# Altium project HARSH_Payload.PrjPCB (part 1 of 2)
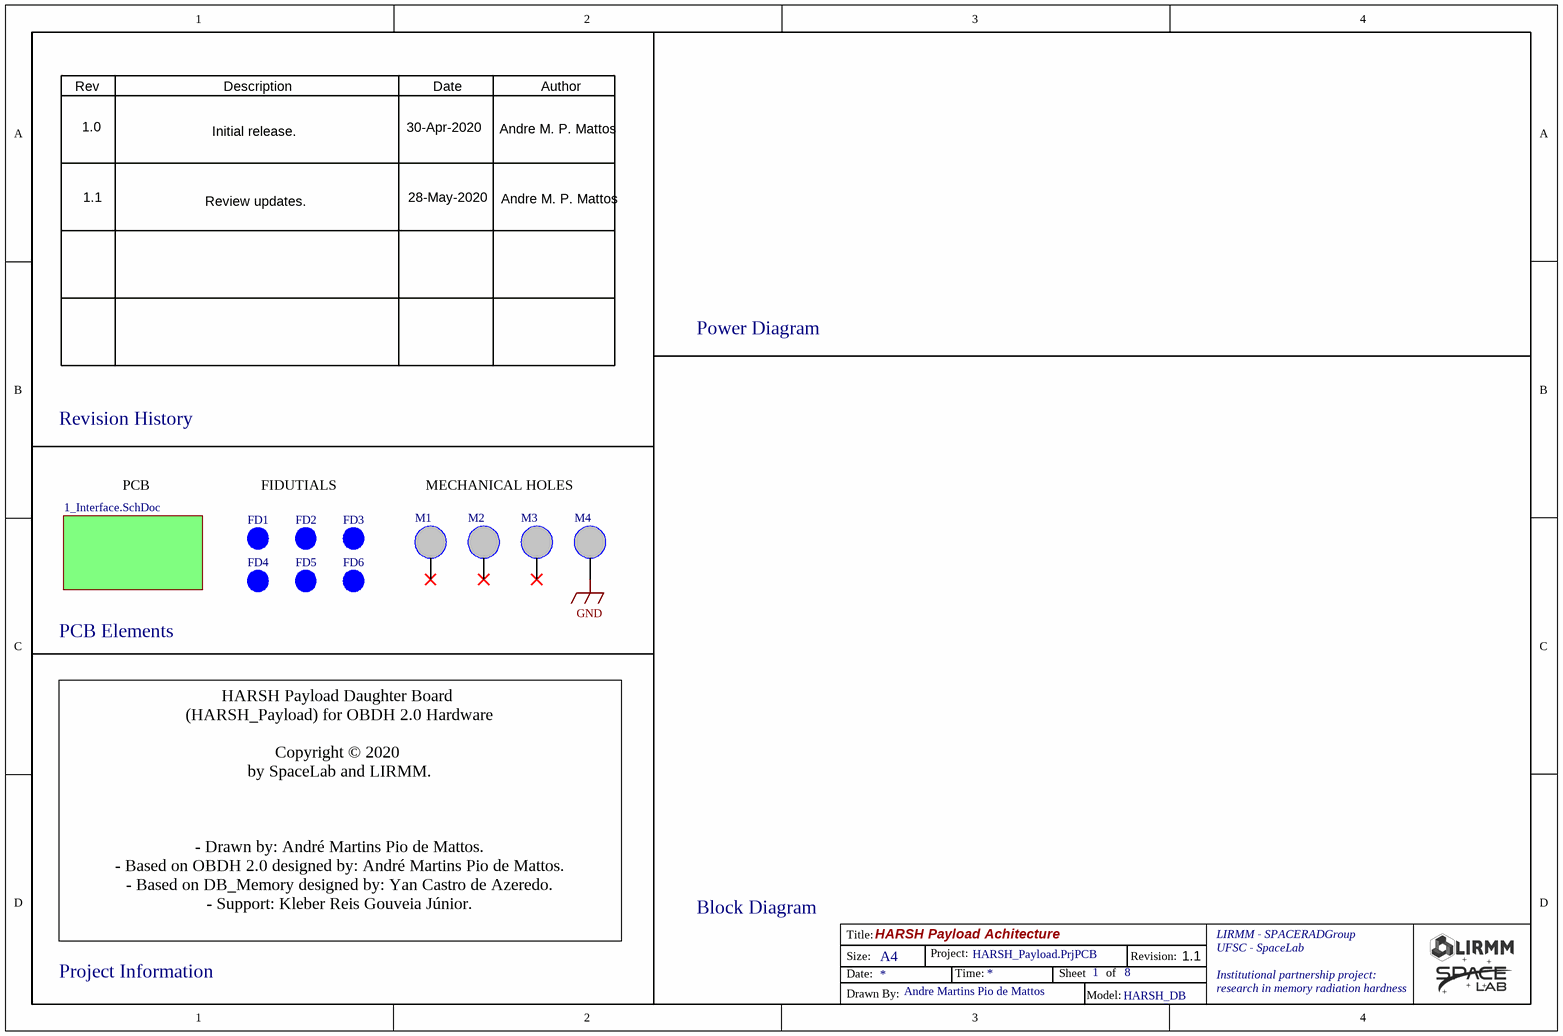
[diagram p0: 0_Architecture.SchDoc]
8 sheets, 143 parts. Net scope: flat (ports and power ports of the same name join across sheets).
Board file: HARSH_Payload.PcbDoc
Sheets:
  0_Architecture.SchDoc
    Interface = 1_Interface.SchDoc
      Topology = 2_Topology.SchDoc
        Memories = 3_SDRAM_Memories.SchDoc
        Banks_0_2 = 4_FPGA_Banks_0_2.SchDoc
        Banks_4_7 = 5_FPGA_Banks_4_7.SchDoc
        Power_Supply = 7_Power_Supply.SchDoc
        FPGA_Misc = 6_FPGA_Miscellaneous.SchDoc

## Sheet 0_Architecture.SchDoc
size A4; Organization: SpaceLab UFSC; Address1: UFSC - SpaceLab; Address2: University Campus - Trindade; Address3: Dep. of Electrical Engineering - CTC; Address4: Florianópolis, Santa Catarina, Brazil; Address5: CEP: 88040 - 900

### Parts
FD1  DONE_FIDUCIAL  [DONE_FIDUCIAL]  (value not drawn)
FD2  DONE_FIDUCIAL  [DONE_FIDUCIAL]  (value not drawn)
FD3  DONE_FIDUCIAL  [DONE_FIDUCIAL]  (value not drawn)
FD4  DONE_FIDUCIAL  [DONE_FIDUCIAL]  (value not drawn)
FD5  DONE_FIDUCIAL  [DONE_FIDUCIAL]  (value not drawn)
FD6  DONE_FIDUCIAL  [DONE_FIDUCIAL]  (value not drawn)
M1  DONE_MOUNT_HOLE  [DONE_M3_MOUNT_HOLE]  (value not drawn)
M2  DONE_MOUNT_HOLE  [DONE_M3_MOUNT_HOLE]  (value not drawn)
M3  DONE_MOUNT_HOLE  [DONE_M3_MOUNT_HOLE]  (value not drawn)
M4  DONE_MOUNT_HOLE  [DONE_M3_MOUNT_HOLE]  (value not drawn)

### Sub-sheets
Interface = 1_Interface.SchDoc: no entries

### Nets
GND: M4.0

Not connected (* = marked no-connect by the designer): M1 0*; M2 0*; M3 0*

### Notes on the sheet
- Rev
- Description
- Date
- Author
- 1.0
- Initial release.
- 30-Apr-2020
- Andre M. P. Mattos
- 1.1
- Review updates.
- 28-May-2020
- Power Diagram
- Revision History
- PCB
- FIDUTIALS
- MECHANICAL HOLES
- PCB Elements
- Block Diagram
- HARSH Payload Daughter Board
  (HARSH_Payload) for OBDH 2.0 Hardware
  Copyright © 2020
  by SpaceLab and LIRMM.
  - Drawn by: André Martins Pio de Mattos.
  - Based on OBDH 2.0 designed by: André Martins Pio de Mattos.
  - Based on DB_Memory designed by: Yan Castro de Azeredo.
  - Support: Kleber Reis Gouveia Júnior.
- Project Information
- HARSH Payload Achitecture
- HARSH_Payload.PrjPCB
- 1
- 8
- Andre Martins Pio de Mattos
- HARSH_DB
- Title:
- Size:
- Date:
- A4
- Project:
- Time:
- Sheet
- of
- Revision:
- LIRMM - SPACERADGroup
- UFSC - SpaceLab
- Institutional partnership project:
- research in memory radiation hardness
- Drawn By:
- Model:

### Library data of the parts
FD1-FD6 = DONE_FIDUCIAL: Fiducial for DB board variants
M1-M4 = DONE_MOUNT_HOLE: Mechanical Hole for DB board variants

## Sheet 1_Interface.SchDoc
size A4; Organization: SpaceLab UFSC; Address1: UFSC - SpaceLab; Address2: University Campus - Trindade; Address3: Dep. of Electrical Engineering - CTC; Address4: Florianópolis, Santa Catarina, Brazil; Address5: CEP: 88040 - 900
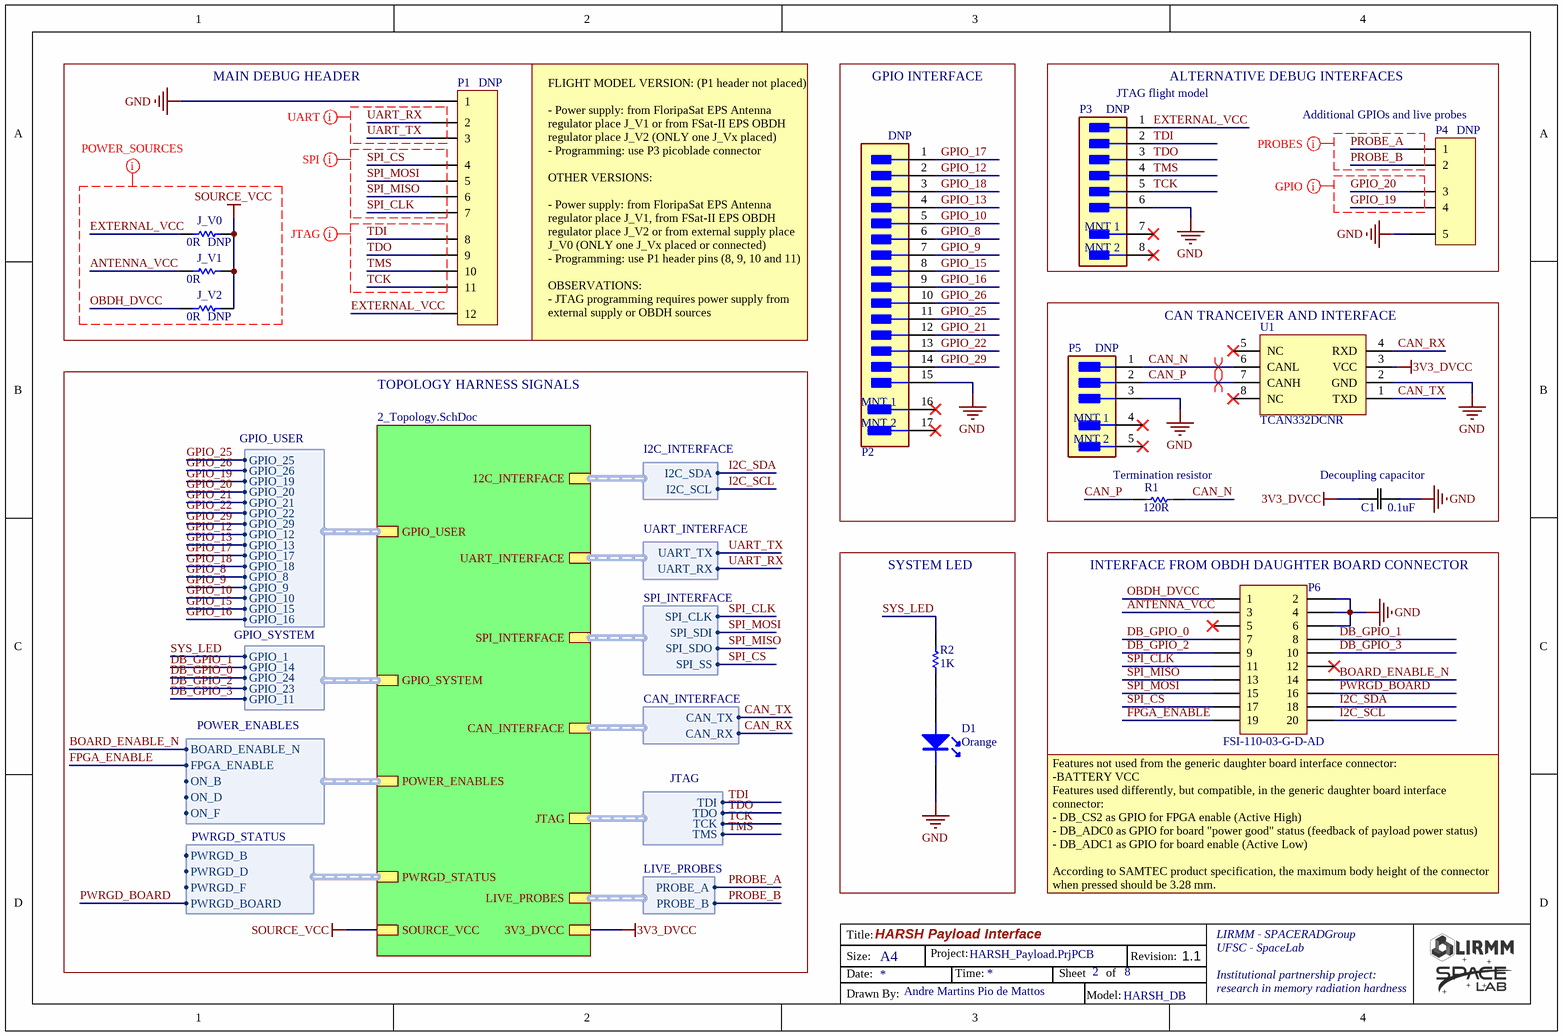
[diagram p1: 1_Interface.SchDoc]

### Parts
C1  Capacitance: 0.1uF  [DONE_C0603]  (hidden comment: 100nF/50V)
D1  Orange  [DONE_D0603_ORANGE]
J_V0  0R  [DONE_R0603]
J_V1  0R  [DONE_R0603]
J_V2  0R  [DONE_R0603]
P1  Header 12H  [DONE_H1X12_PADS]  (value not drawn)
P2  53261-1571  [DONE_PICOBLADE_15H_HORIZONTAL]  (value not drawn)
P3  53261-0671  [DONE_PICOBLADE_6H_HORIZONTAL]  (value not drawn)
P4  Header 5H  [DONE_H1X5_PADS]  (value not drawn)
P5  53261-0371  [DONE_PICOBLADE_3H_HORIZONTAL]  (value not drawn)
P6  FSI-110-03-G-D-AD  [DONE_DB_INTERFACE]
R1  120R  [DONE_R0603]
R2  1K  [DONE_R0603]
U1  TCAN332DCNR  [DONE_TSOT_23_8]

### Blocks framed on the sheet
MAIN DEBUG HEADER: J_V0-J_V2 P1
GPIO INTERFACE: P2
ALTERNATIVE DEBUG INTERFACES: P3 P4
CAN TRANCEIVER AND INTERFACE: C1 P5 R1 U1
SYSTEM LED: D1 R2
INTERFACE FROM OBDH DAUGHTER BOARD CONNECTOR: P6

### Sub-sheets
Topology = 2_Topology.SchDoc: UART_INTERFACE (harness UART_INTERFACE), POWER_ENABLES (harness POWER_ENABLES), GPIO_USER (harness GPIO_USER), GPIO_SYSTEM (harness GPIO_SYSTEM), CAN_INTERFACE (harness CAN_INTERFACE), 12C_INTERFACE (harness I2C_INTERFACE), 3V3_DVCC, SOURCE_VCC, SPI_INTERFACE (harness SPI_INTERFACE), PWRGD_STATUS (harness PWRGD_STATUS), JTAG (harness JTAG), LIVE_PROBES (harness LIVE_PROBES)

### Harnesses
CAN_INTERFACE: CAN_TX, CAN_RX
SPI_INTERFACE: SPI_SDO, SPI_SDI, SPI_SS, SPI_CLK
I2C_INTERFACE: I2C_SDA, I2C_SCL
UART_INTERFACE: UART_TX, UART_RX
JTAG: TMS, TCK, TDO, TDI
GPIO_USER: GPIO_25, GPIO_26, GPIO_19, GPIO_20, GPIO_21, GPIO_22, GPIO_29, GPIO_12, GPIO_13, GPIO_17, GPIO_18, GPIO_8, GPIO_9, GPIO_10, GPIO_15, GPIO_16
LIVE_PROBES: PROBE_A, PROBE_B
GPIO_SYSTEM: GPIO_1, GPIO_14, GPIO_24, GPIO_23, GPIO_11
POWER_ENABLES: FPGA_ENABLE, ON_B, BOARD_ENABLE_N, ON_D, ON_F
PWRGD_STATUS: PWRGD_B, PWRGD_D, PWRGD_F, PWRGD_BOARD

### Nets
3V3_DVCC: C1.1 U1.3(VCC) ; sheet Topology/3V3_DVCC
GND: C1.2 D1.2(K) P1.1 P2.15 P3.6 P4.5 P5.3 P6.2 P6.4 P6.6 U1.2(GND)
SOURCE_VCC: J_V0.1 J_V1.1 J_V2.1 ; sheet Topology/SOURCE_VCC
ANTENNA_VCC: J_V1.2 P6.3
BOARD_ENABLE_N: P6.14 ; sheet Topology/POWER_ENABLES.BOARD_ENABLE_N
CAN_N: P5.1 R1.1 U1.6(CANL)
CAN_P: P5.2 R1.2 U1.7(CANH)
CAN_RX: U1.4(RXD) ; sheet Topology/CAN_INTERFACE.CAN_RX
CAN_TX: U1.1(TXD) ; sheet Topology/CAN_INTERFACE.CAN_TX
DB_GPIO_0: P6.7 ; sheet Topology/GPIO_SYSTEM.GPIO_24
DB_GPIO_1: P6.8 ; sheet Topology/GPIO_SYSTEM.GPIO_14
DB_GPIO_2: P6.9 ; sheet Topology/GPIO_SYSTEM.GPIO_23
DB_GPIO_3: P6.10 ; sheet Topology/GPIO_SYSTEM.GPIO_11
EXTERNAL_VCC: J_V0.2 P1.12 P3.1
FPGA_ENABLE: P6.19 ; sheet Topology/POWER_ENABLES.FPGA_ENABLE
GPIO_8: P2.6 ; sheet Topology/GPIO_USER.GPIO_8
GPIO_9: P2.7 ; sheet Topology/GPIO_USER.GPIO_9
GPIO_10: P2.5 ; sheet Topology/GPIO_USER.GPIO_10
GPIO_12: P2.2 ; sheet Topology/GPIO_USER.GPIO_12
GPIO_13: P2.4 ; sheet Topology/GPIO_USER.GPIO_13
GPIO_15: P2.8 ; sheet Topology/GPIO_USER.GPIO_15
GPIO_16: P2.9 ; sheet Topology/GPIO_USER.GPIO_16
GPIO_17: P2.1 ; sheet Topology/GPIO_USER.GPIO_17
GPIO_18: P2.3 ; sheet Topology/GPIO_USER.GPIO_18
GPIO_19: P4.4 ; sheet Topology/GPIO_USER.GPIO_19
GPIO_20: P4.3 ; sheet Topology/GPIO_USER.GPIO_20
GPIO_21: P2.12 ; sheet Topology/GPIO_USER.GPIO_21
GPIO_22: P2.13 ; sheet Topology/GPIO_USER.GPIO_22
GPIO_25: P2.11 ; sheet Topology/GPIO_USER.GPIO_25
GPIO_26: P2.10 ; sheet Topology/GPIO_USER.GPIO_26
GPIO_29: P2.14 ; sheet Topology/GPIO_USER.GPIO_29
I2C_SCL: P6.20 ; sheet Topology/12C_INTERFACE.I2C_SCL
I2C_SDA: P6.18 ; sheet Topology/12C_INTERFACE.I2C_SDA
OBDH_DVCC: J_V2.2 P6.1
PROBE_A: P4.1 ; sheet Topology/LIVE_PROBES.PROBE_A
PROBE_B: P4.2 ; sheet Topology/LIVE_PROBES.PROBE_B
PWRGD_BOARD: P6.16 ; sheet Topology/PWRGD_STATUS.PWRGD_BOARD
SPI_CLK: P1.7 P6.11 ; sheet Topology/SPI_INTERFACE.SPI_CLK
SPI_CS: P1.4 P6.17 ; sheet Topology/SPI_INTERFACE.SPI_SS
SPI_MISO: P1.6 P6.13 ; sheet Topology/SPI_INTERFACE.SPI_SDO
SPI_MOSI: P1.5 P6.15 ; sheet Topology/SPI_INTERFACE.SPI_SDI
SYS_LED: R2.2 ; sheet Topology/GPIO_SYSTEM.GPIO_1
TCK: P1.11 P3.5 ; sheet Topology/JTAG.TCK
TDI: P1.8 P3.2 ; sheet Topology/JTAG.TDI
TDO: P1.9 P3.3 ; sheet Topology/JTAG.TDO
TMS: P1.10 P3.4 ; sheet Topology/JTAG.TMS
UART_RX: P1.2 ; sheet Topology/UART_INTERFACE.UART_RX
UART_TX: P1.3 ; sheet Topology/UART_INTERFACE.UART_TX
NetD1_1: D1.1(A) R2.1

Not connected (* = marked no-connect by the designer): P2 16(MNT_1)* 17(MNT_2)*; P3 7(MNT_1)* 8(MNT_2)*; P5 4(MNT_1)* 5(MNT_2)*; P6 5* 12*; U1 5(NC)* 8(NC)*

### Layout directives
net class NetClass: ANTENNA_VCC, EXTERNAL_VCC, GPIO_19, GPIO_20, OBDH_DVCC, PROBE_A, PROBE_B, SOURCE_VCC, SPI_CLK, SPI_CS, SPI_MISO, SPI_MOSI, TCK, TDI, TDO, TMS, UART_RX, UART_TX
differential pair: CAN_N, CAN_P

### Notes on the sheet
- (near P1) DNP
- (near P3) DNP
- (near P3) JTAG flight model
- (near P2) DNP
- (near P4) Additional GPIOs and live probes
- (near P4) DNP
- (near J_V0) DNP
- (near J_V2) DNP
- FLIGHT MODEL VERSION: (P1 header not placed)
  - Power supply: from FloripaSat EPS Antenna regulator place J_V1 or from FSat-II EPS OBDH regulator place J_V2 (ONLY one J_Vx placed)
  - Programming: use P3 picoblade connector
  OTHER VERSIONS:
  - Power supply: from FloripaSat EPS Antenna regulator place J_V1, from FSat-II EPS OBDH regulator place J_V2 or from external supply place J_V0 (ONLY one J_Vx placed or connected)
  - Programming: use P1 header pins (8, 9, 10 and 11)
  OBSERVATIONS:
  - JTAG programming requires power supply from external supply or OBDH sources
- (near P5) DNP
- TOPOLOGY HARNESS SIGNALS
- Termination resistor
- (near C1) Decoupling capacitor
- (near P6) Features not used from the generic daughter board interface connector:
  -BATTERY VCC
  Features used differently, but compatible, in the generic daughter board interface connector:
  - DB_CS2 as GPIO for FPGA enable (Active High)
  - DB_ADC0 as GPIO for board "power good" status (feedback of payload power status)
  - DB_ADC1 as GPIO for board enable (Active Low)
  According to SAMTEC product specification, the maximum body height of the connector when pressed should be 3.28 mm.
- HARSH Payload Interface
- HARSH_Payload.PrjPCB
- 2
- 8
- 1.1
- Andre Martins Pio de Mattos
- HARSH_DB
- Title:
- Size:
- Date:
- A4
- Project:
- Time:
- Sheet
- of
- Revision:
- LIRMM - SPACERADGroup
- UFSC - SpaceLab
- Institutional partnership project:
- research in memory radiation hardness
- Drawn By:
- Model:

### Library data of the parts
C1 = DONE_CAP_0.1uF_0603_X7R: CAP CER 100nF 50V 0603 10%; Partnumber: C0603C104K5RAC3121; Manufacturer: Yageo; Dielectric: X7R; NCM: 8532.24.10; ComponentLink1Description: https://www.digikey.com/product-detail/en/yageo/CC0201KRX7R9BB101/311-1401-1-ND/2833707; ComponentLink1URL: https://www.digikey.com/product-detail/en/yageo/CC0201KRX7R9BB101/311-1401-1-ND/2833707; ComponentLink2Description: https://br.mouser.com/ProductDetail/Yageo/CC0201KRX7R9BB101?qs=%2Fha2pyFaduiYipKOFrxfqt3%252B9aGSfhofiweIoBBppi5CkwQHqUahpQ%3D%3D; ComponentLink2URL: https://br.mouser.com/ProductDetail/Yageo/CC0201KRX7R9BB101?qs=%2Fha2pyFaduiYipKOFrxfqt3%252B9aGSfhofiweIoBBppi5CkwQHqUahpQ%3D%3D; Supplier 1: Digi-Key; Supplier Part Number 1: 311-1401-1-ND; Stock 1: 203642; Pricing 1: 1=0.1, 10=0.017, 100=0.0078, 500=0.00554, 1000=0.00436, 2500=0.00396, 5000=0.00364 (USD); Mount: Surface Mount; Case/Package: 0201; Weight: 6E-06oz; Case Code (Metric): 0603; Case Code (Imperial): 0201; Min Operating Temperature: -55°C; Max Operating Temperature: 125°C; Tolerance: 10%; Package Quantity: 1; Voltage Rating: 50V; Packaging: Tape and Reel; Voltage Rating (DC): 50V; Termination: SMD/SMT; Composition: Ceramic; Length: 0.6mm; Height: 0.3mm; Width: 0.012inch; Thickness: 0.013inch; Depth: 0.3mm; Radiation Hardening: No; Lead Free: Lead Free; Halogen Free: Halogen Free; ComponentLink3URL: http://www.yageo.com/documents/recent/UPY-GPHC_X7R_6.3V-to-50V_18.pdf?src-supplier=Digi-Key; ComponentLink3Description: http://www.yageo.com/documents/recent/UPY-GPHC_X7R_6.3V-to-50V_18.pdf?src-supplier=Digi-Key; ComponentLink4URL: http://www.yageo.com/documents/recent/UPY-GPHC_X7R_6.3V-to-50V_8.pdf?src-supplier=Avnet+Europe; ComponentLink4Description: http://www.yageo.com/documents/recent/UPY-GPHC_X7R_6.3V-to-50V_8.pdf?src-supplier=Avnet+Europe; ComponentLink5URL: http://www.yageo.com/documents/recent/UPY-GPHC_X7R_6.3V-to-50V_8.pdf?src-supplier=Avnet; ComponentLink5Description: http://www.yageo.com/documents/recent/UPY-GPHC_X7R_6.3V-to-50V_8.pdf?src-supplier=Avnet; ComponentLink6URL: http://www.mouser.com/ds/2/447/Yageo_UPY-GP_NP0_16V-to-50V_9-358835.pdf?src-supplier=Mouser; ComponentLink6Description: http://www.mouser.com/ds/2/447/Yageo_UPY-GP_NP0_16V-to-50V_9-358835.pdf?src-supplier=Mouser; Supplier 2: Mouser; Supplier Part Number 2: 603-CC201KRX7R9BB101; Stock 2: 51204; Pricing 2: 1=0.1, 10=0.024, 100=0.011, 1000=0.009, 2500=0.006, 10000=0.006 (USD)
D1 = DONE_LED_ORANGE_0603: SMD Orange LED; Partnumber: HSML-C191-T0000; ComponentLink1Description: https://www.digikey.com/product-detail/en/lite-on-inc/LTST-C170KFKT/160-1413-1-ND/386774; ComponentLink1URL: https://www.digikey.com/product-detail/en/lite-on-inc/LTST-C170KFKT/160-1413-1-ND/386774; ComponentLink2Description: https://br.mouser.com/ProductDetail/Lite-On/LTST-C170KFKT?qs=%2Fha2pyFadugHsX7bdQzWjMrioqtf8F%2FEFUVxYkqdVx%252BrRWuVMVludQ%3D%3D; ComponentLink2URL: https://br.mouser.com/ProductDetail/Lite-On/LTST-C170KFKT?qs=%2Fha2pyFadugHsX7bdQzWjMrioqtf8F%2FEFUVxYkqdVx%252BrRWuVMVludQ%3D%3D; ComponentLink3URL: https://www.verical.com/server-webapp/html/getDatasheet?partID=158266&src-supplier=Verical; ComponentLink3Description: https://www.verical.com/server-webapp/html/getDatasheet?partID=158266&src-supplier=Verical; ComponentLink4URL: http://optoelectronics.liteon.com/upload/download/DS-22-99-0185/LTST-C170KFKT.pdf?src-supplier=Digi-Key; ComponentLink4Description: http://optoelectronics.liteon.com/upload/download/DS-22-99-0185/LTST-C170KFKT.pdf?src-supplier=Digi-Key; ComponentLink5URL: http://www1.futureelectronics.com/doc/LITE-ON/LTST-C170KFKT.pdf?src-supplier=Future+Electronics; ComponentLink5Description: http://www1.futureelectronics.com/doc/LITE-ON/LTST-C170KFKT.pdf?src-supplier=Future+Electronics; ComponentLink6URL: http://www.mouser.com/ds/2/239/Lite-On-LTST-C170KFKT-187690.pdf?src-supplier=Mouser; ComponentLink6Description: http://www.mouser.com/ds/2/239/Lite-On-LTST-C170KFKT-187690.pdf?src-supplier=Mouser
J_V0-J_V2 = DONE_RES_0R_0603: RES SMD 0 OHM JUMPER 1/10W 0603; Partnumber: RC0603JR-070RL; Case Code (Imperial): 0603; ComponentLink1URL: http://www.mouser.com/ds/2/427/mcat_pro-223602.pdf; ComponentLink1Description: http://www.mouser.com/ds/2/427/mcat_pro-223602.pdf; ComponentLink2URL: http://www.vishay.com/docs/28760/mcat_pro.pdf; ComponentLink2Description: http://www.vishay.com/docs/28760/mcat_pro.pdf
P1 = DONE_H1X12_PADS: Header, 12-Pin; LatestRevisionDate: 17-Jul-2002; LatestRevisionNote: Re-released for DXP Platform.; Publisher: Altium Limited
P2 = DONE_PICOBLADE_15H: Picoblade, 15 pos, Right-angle, 53261-1571; Partnumber: 53261-1571
P3 = DONE_PICOBLADE_6H: Picoblade, 6 pos, Right-angle; Partnumber: 53261-0671
P4 = DONE_H1X5_PADS: Header, 5-Pin, Pads; LatestRevisionDate: 17-Jul-2002; LatestRevisionNote: Re-released for DXP Platform.; Publisher: Altium Limited
P5 = DONE_PICOBLADE_3H: Picoblade, 3 pos, Right-angle; Partnumber: 53261-0371
P6 = DONE_DB_INTERFACE: CONN STACKING 20POS SMD GOLD; Manufacturer: Samtec; Number of Contacts: 20; Gender: Male; Pitch: 1mm; Value: *; Partnumber: FSI-110-03-G-D-AD; ComponentLink1Description: https://www.digikey.com/product-detail/en/samtec-inc/FSI-110-03-G-D-AD/SAM9412-ND/6678149; ComponentLink1URL: https://www.digikey.com/product-detail/en/samtec-inc/FSI-110-03-G-D-AD/SAM9412-ND/6678149; ComponentLink2Description: https://br.mouser.com/ProductDetail/Samtec/FSI-110-03-G-D-AD?qs=sGAEpiMZZMvffgRu4KC1RxM6nKwEP14AvPoIU%2FGiIRnIunfAN0MvNQ%3D%3D; ComponentLink2URL: https://br.mouser.com/ProductDetail/Samtec/FSI-110-03-G-D-AD?qs=sGAEpiMZZMvffgRu4KC1RxM6nKwEP14AvPoIU%2FGiIRnIunfAN0MvNQ%3D%3D; Supplier 1: Digi-Key; Supplier Part Number 1: SAM9412-ND; Stock 1: 100; Pricing 1: 1=6.6, 10=6.325, 25=5.7752, 50=5.5, 100=5.225, 250=4.675, 500=4.4, 1000=3.85, 2500=3.6575 (USD); Mount: Surface Mount; Contact Plating: Gold; Contact Material: Copper; Number of Rows: 2; Termination: Solder; Radiation Hardening: No; REACH SVHC: No SVHC; ComponentLink3URL: http://www.samtec.com/ftppub/pdf/FSI_03.PDF?src-supplier=Avnet+Europe; ComponentLink3Description: http://www.samtec.com/ftppub/pdf/FSI_03.PDF?src-supplier=Avnet+Europe; Supplier 2: Mouser; Supplier Part Number 2: 200-FSI11003GDAD; Stock 2: 50; Pricing 2: 1=6.59, 10=5.5, 100=4.68, 250=4.17, 500=3.84, 1000=3.6 (USD); Manufacturer Part Number: FSI-110-03-G-D-AD
R1 = DONE_RES_120R_0603: 120R 1% 0603; Partnumber: RC0603FR-07120RL; Resistance: 120R
R2 = DONE_RES_1K_0603: RES SMD 1K OHM 1% 1/4W 0603; Manufacturer: Rohm; Manufacturer Part Number: ESR03EZPF1001; Power Rating: 250mW; Temperature Coefficient: 100ppm/°C; ComponentLink1Description: digikey; ComponentLink1URL: https://www.digikey.com/product-detail/en/rohm-semiconductor/ESR03EZPF1001/RHM1.00KADCT-ND/1983752; Supplier 1: Digi-Key; Stock 1: 24170; Pricing 1: 1=0.14, 10=0.126, 100=0.0484, 1000=0.0213, 2500=0.0184 (USD); Case/Package: 0603; Case Code (Metric): 1608; Case Code (Imperial): 0603; Min Operating Temperature: -55°C; Max Operating Temperature: 155°C; Package Quantity: 1; Tolerance: 1%; Packaging: Tape and Reel; Composition: Thick Film; Number of Terminations: 2; Max Power Dissipation: 250mW; Length: 0.063inch; Height: 0.022inch; Width: 0.031inch; Lead Free: Lead Free; ComponentLink2URL: https://datasheet.ciiva.com/2469/esr-2469712.pdf; ComponentLink2Description: https://datasheet.ciiva.com/2469/esr-2469712.pdf; ComponentLink3URL: https://datasheet.ciiva.com/2469/esr-2469713.pdf; ComponentLink3Description: https://datasheet.ciiva.com/2469/esr-2469713.pdf; ComponentLink4URL: https://datasheet.ciiva.com/2469/esr-2469714.pdf; ComponentLink4Description: https://datasheet.ciiva.com/2469/esr-2469714.pdf; Supplier Part Number 1: RHM1.00KADCT-ND; Resistance: 1K; Partnumber: ESR03EZPF1001
U1 = DONE_TCAN332DCNR: Tranceiver CAN, 8-pin SOT23; Manufacturer: Texas Instruments; Mounting Technology: Surface Mount; ComponentLink1Description: Manufacturer URL; ComponentLink2Description: Datasheet; ComponentLink3URL: http://cds.linear.com/docs/en/packaging/SOT_8_05-08-1637.pdf; ComponentLink1URL: http://www.linear.com/; ComponentLink2URL: http://cds.linear.com/docs/en/datasheet/436112fb.pdf; ComponentLink3Description: Package Specification; PackageDescription: 8-Pin Plastic TSOT-23, Body 2.9 x 1.63 mm, Pitch 0.65 mm; PartNumber: TCAN332DCNR

## Sheet 2_Topology.SchDoc
size A4; Organization: SpaceLab UFSC; Address1: UFSC - SpaceLab; Address2: University Campus - Trindade; Address3: Dep. of Electrical Engineering - CTC; Address4: Florianópolis, Santa Catarina, Brazil; Address5: CEP: 88040 - 900
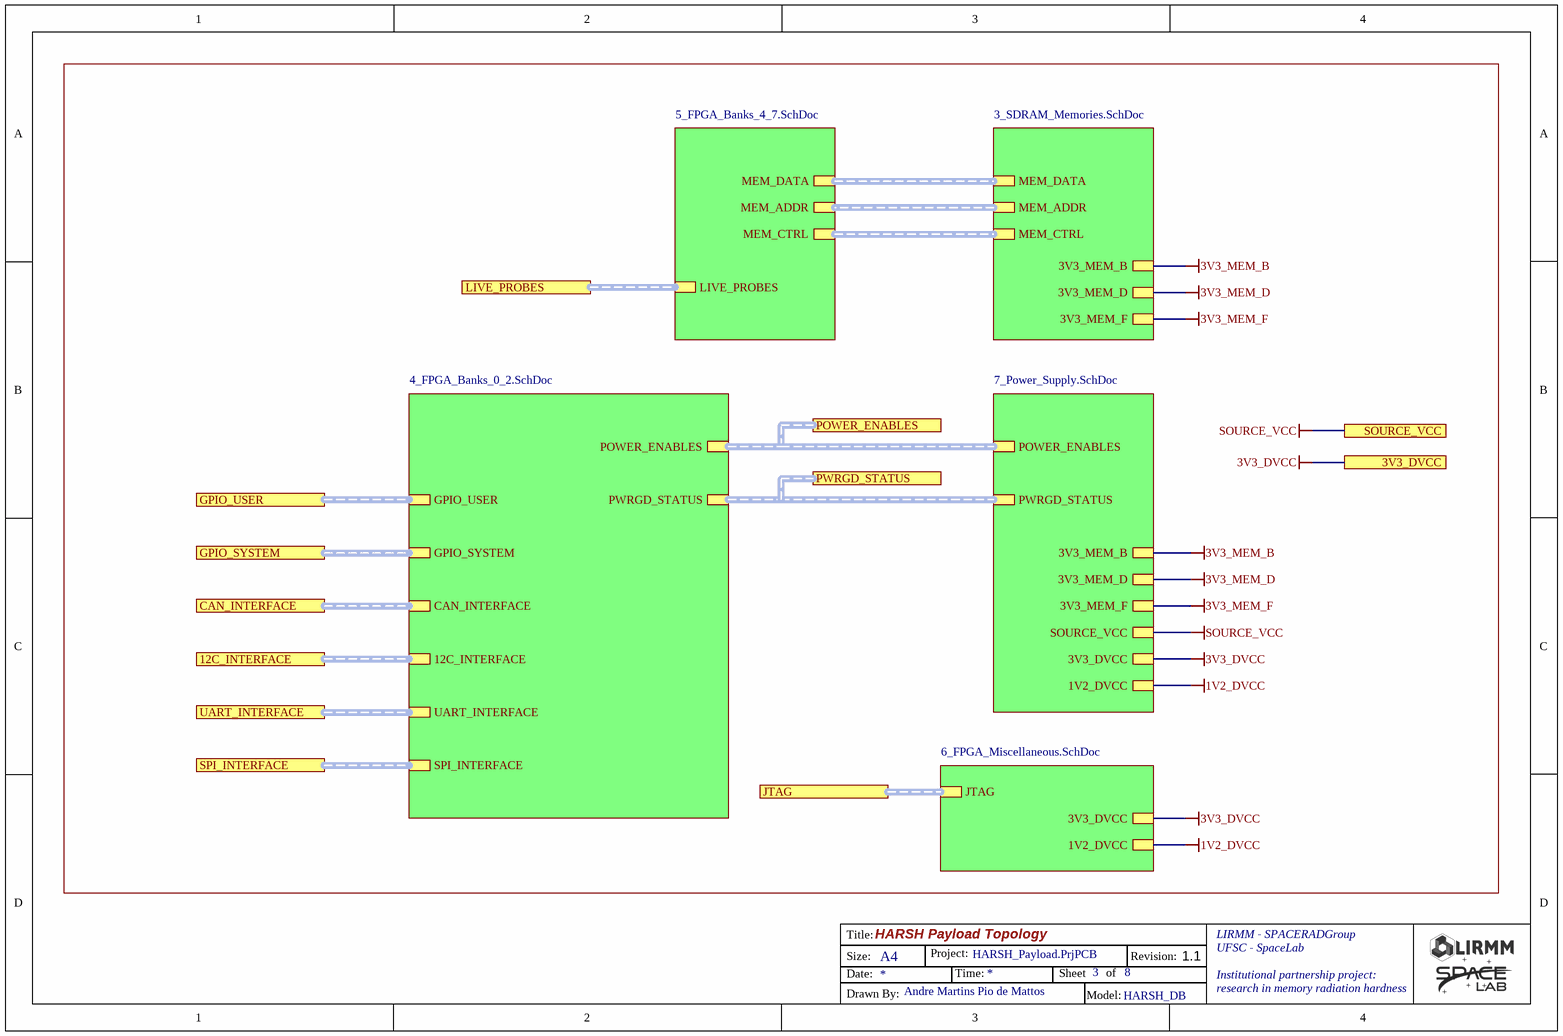
[diagram p2: 2_Topology.SchDoc]

### Sub-sheets
Banks_0_2 = 4_FPGA_Banks_0_2.SchDoc: GPIO_SYSTEM (harness GPIO_SYSTEM), POWER_ENABLES (harness POWER_ENABLES), GPIO_USER (harness GPIO_USER), CAN_INTERFACE (harness CAN_INTERFACE), 12C_INTERFACE (harness I2C_INTERFACE), UART_INTERFACE (harness UART_INTERFACE), SPI_INTERFACE (harness SPI_INTERFACE), PWRGD_STATUS (harness PWRGD_STATUS)
Banks_4_7 = 5_FPGA_Banks_4_7.SchDoc: MEM_DATA (harness MEM_DATA), MEM_ADDR (harness MEM_ADDR), MEM_CTRL (harness MEM_CTRL), LIVE_PROBES (harness LIVE_PROBES)
FPGA_Misc = 6_FPGA_Miscellaneous.SchDoc: JTAG (harness JTAG), 3V3_DVCC, 1V2_DVCC
Memories = 3_SDRAM_Memories.SchDoc: MEM_DATA (harness MEM_DATA), MEM_ADDR (harness MEM_ADDR), MEM_CTRL (harness MEM_CTRL), 3V3_MEM_B, 3V3_MEM_D, 3V3_MEM_F
Power_Supply = 7_Power_Supply.SchDoc: POWER_ENABLES (harness POWER_ENABLES), 3V3_DVCC, 1V2_DVCC, SOURCE_VCC, 3V3_MEM_B, 3V3_MEM_D, 3V3_MEM_F, PWRGD_STATUS (harness PWRGD_STATUS)

### Ports
3V3_DVCC, 12C_INTERFACE (harness I2C_INTERFACE), CAN_INTERFACE (harness CAN_INTERFACE), GPIO_SYSTEM (harness GPIO_SYSTEM), GPIO_USER (harness GPIO_USER), JTAG (harness GPIO_USER), LIVE_PROBES (harness GPIO_USER), POWER_ENABLES (harness POWER_ENABLES), PWRGD_STATUS (harness POWER_ENABLES), SOURCE_VCC, SPI_INTERFACE (harness SPI_INTERFACE), UART_INTERFACE (harness UART_INTERFACE)

### Nets
1V2_DVCC: sheet Power_Supply/1V2_DVCC, sheet FPGA_Misc/1V2_DVCC
3V3_DVCC: port 3V3_DVCC, sheet Power_Supply/3V3_DVCC, sheet FPGA_Misc/3V3_DVCC
3V3_MEM_B: sheet Memories/3V3_MEM_B, sheet Power_Supply/3V3_MEM_B
3V3_MEM_D: sheet Memories/3V3_MEM_D, sheet Power_Supply/3V3_MEM_D
3V3_MEM_F: sheet Memories/3V3_MEM_F, sheet Power_Supply/3V3_MEM_F
SOURCE_VCC: port SOURCE_VCC, sheet Power_Supply/SOURCE_VCC

### Buses and harness runs
harness port 12C_INTERFACE = sheet Banks_0_2/12C_INTERFACE
harness port CAN_INTERFACE = sheet Banks_0_2/CAN_INTERFACE
harness port GPIO_SYSTEM = sheet Banks_0_2/GPIO_SYSTEM
harness port GPIO_USER = sheet Banks_0_2/GPIO_USER
harness port JTAG = sheet FPGA_Misc/JTAG
harness port LIVE_PROBES = sheet Banks_4_7/LIVE_PROBES
harness port POWER_ENABLES = sheet Banks_0_2/POWER_ENABLES = sheet Power_Supply/POWER_ENABLES
harness port PWRGD_STATUS = sheet Banks_0_2/PWRGD_STATUS = sheet Power_Supply/PWRGD_STATUS
harness port SPI_INTERFACE = sheet Banks_0_2/SPI_INTERFACE
harness port UART_INTERFACE = sheet Banks_0_2/UART_INTERFACE
harness sheet Banks_4_7/MEM_ADDR = sheet Memories/MEM_ADDR
harness sheet Banks_4_7/MEM_CTRL = sheet Memories/MEM_CTRL
harness sheet Banks_4_7/MEM_DATA = sheet Memories/MEM_DATA

### Notes on the sheet
- HARSH Payload Topology
- HARSH_Payload.PrjPCB
- 3
- 8
- 1.1
- Andre Martins Pio de Mattos
- HARSH_DB
- Title:
- Size:
- Date:
- A4
- Project:
- Time:
- Sheet
- of
- Revision:
- LIRMM - SPACERADGroup
- UFSC - SpaceLab
- Institutional partnership project:
- research in memory radiation hardness
- Drawn By:
- Model:

## Sheet 3_SDRAM_Memories.SchDoc
size A4; Organization: SpaceLab UFSC; Address1: UFSC - SpaceLab; Address2: University Campus - Trindade; Address3: Dep. of Electrical Engineering - CTC; Address4: Florianópolis, Santa Catarina, Brazil; Address5: CEP: 88040 - 900
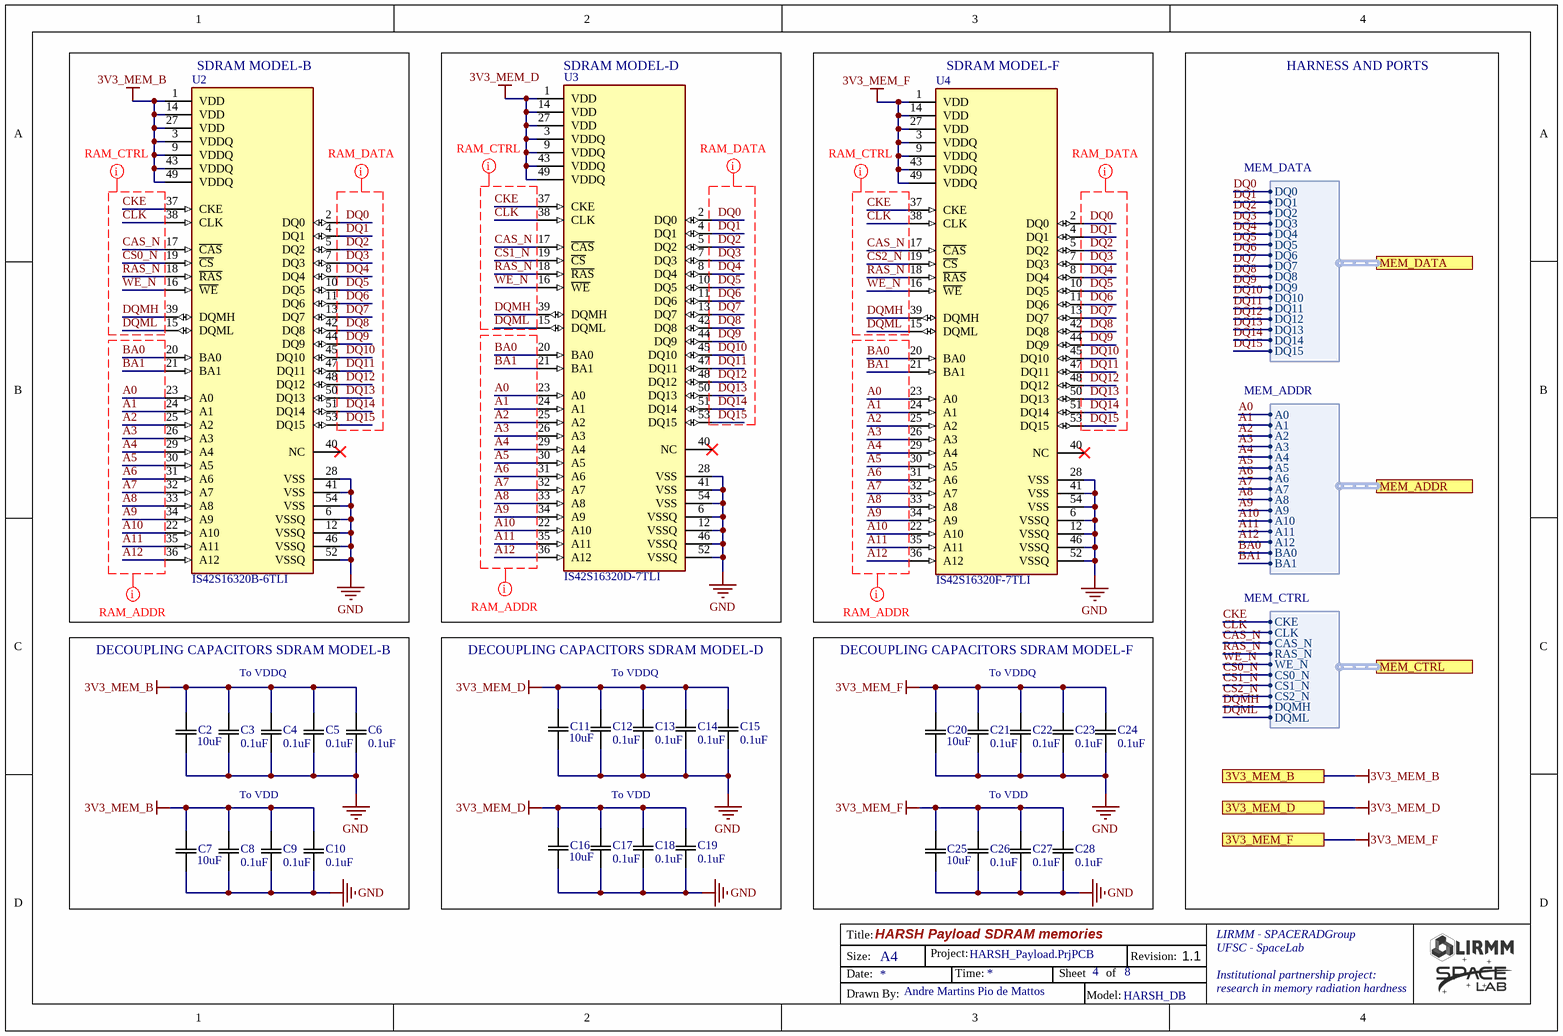
[diagram p3: 3_SDRAM_Memories.SchDoc]

### Parts
C2  10uF  [DONE_C0603]
C3  Capacitance: 0.1uF  [DONE_C0603]  (hidden comment: 100nF/50V)
C4  Capacitance: 0.1uF  [DONE_C0603]  (hidden comment: 100nF/50V)
C5  Capacitance: 0.1uF  [DONE_C0603]  (hidden comment: 100nF/50V)
C6  Capacitance: 0.1uF  [DONE_C0603]  (hidden comment: 100nF/50V)
C7  10uF  [DONE_C0603]
C8  Capacitance: 0.1uF  [DONE_C0603]  (hidden comment: 100nF/50V)
C9  Capacitance: 0.1uF  [DONE_C0603]  (hidden comment: 100nF/50V)
C10  Capacitance: 0.1uF  [DONE_C0603]  (hidden comment: 100nF/50V)
C11  10uF  [DONE_C0603]
C12  Capacitance: 0.1uF  [DONE_C0603]  (hidden comment: 100nF/50V)
C13  Capacitance: 0.1uF  [DONE_C0603]  (hidden comment: 100nF/50V)
C14  Capacitance: 0.1uF  [DONE_C0603]  (hidden comment: 100nF/50V)
C15  Capacitance: 0.1uF  [DONE_C0603]  (hidden comment: 100nF/50V)
C16  10uF  [DONE_C0603]
C17  Capacitance: 0.1uF  [DONE_C0603]  (hidden comment: 100nF/50V)
C18  Capacitance: 0.1uF  [DONE_C0603]  (hidden comment: 100nF/50V)
C19  Capacitance: 0.1uF  [DONE_C0603]  (hidden comment: 100nF/50V)
C20  10uF  [DONE_C0603]
C21  Capacitance: 0.1uF  [DONE_C0603]  (hidden comment: 100nF/50V)
C22  Capacitance: 0.1uF  [DONE_C0603]  (hidden comment: 100nF/50V)
C23  Capacitance: 0.1uF  [DONE_C0603]  (hidden comment: 100nF/50V)
C24  Capacitance: 0.1uF  [DONE_C0603]  (hidden comment: 100nF/50V)
C25  10uF  [DONE_C0603]
C26  Capacitance: 0.1uF  [DONE_C0603]  (hidden comment: 100nF/50V)
C27  Capacitance: 0.1uF  [DONE_C0603]  (hidden comment: 100nF/50V)
C28  Capacitance: 0.1uF  [DONE_C0603]  (hidden comment: 100nF/50V)
U2  IS42S16320B-6TLI  [DONE_ISSI_MEM_TSOP_54]
U3  IS42S16320D-7TLI  [DONE_ISSI_MEM_TSOP_54]
U4  IS42S16320F-7TLI  [DONE_ISSI_MEM_TSOP_54]

### Blocks framed on the sheet
SDRAM MODEL-B: U2
SDRAM MODEL-D: U3
SDRAM MODEL-F: U4
DECOUPLING CAPACITORS SDRAM MODEL-B: C2-C10
DECOUPLING CAPACITORS SDRAM MODEL-D: C11-C19
DECOUPLING CAPACITORS SDRAM MODEL-F: C20-C28

### Ports
3V3_MEM_B, 3V3_MEM_D, 3V3_MEM_F, MEM_ADDR (harness MEM_ADDR), MEM_CTRL (harness MEM_CTRL), MEM_DATA (harness MEM_DATA)

### Harnesses
MEM_DATA: DQ0, DQ1, DQ2, DQ3, DQ4, DQ5, DQ6, DQ7, DQ8, DQ9, DQ10, DQ11, DQ12, DQ13, DQ14, DQ15
MEM_ADDR: A0, A1, A2, A3, A4, A5, A6, A7, A8, A9, A10, A11, A12, BA0, BA1
MEM_CTRL: CKE, CLK, CAS_N, RAS_N, WE_N, CS0_N, CS1_N, CS2_N, DQMH, DQML

### Nets
3V3_MEM_B: C2.1 C3.1 C4.1 C5.1 C6.1 C7.1 C8.1 C9.1 C10.1 U2.1(VDD) U2.3(VDDQ) U2.9(VDDQ) U2.14(VDD) U2.27(VDD) U2.43(VDDQ) U2.49(VDDQ) ; port 3V3_MEM_B
3V3_MEM_D: C11.1 C12.1 C13.1 C14.1 C15.1 C16.1 C17.1 C18.1 C19.1 U3.1(VDD) U3.3(VDDQ) U3.9(VDDQ) U3.14(VDD) U3.27(VDD) U3.43(VDDQ) U3.49(VDDQ) ; port 3V3_MEM_D
3V3_MEM_F: C20.1 C21.1 C22.1 C23.1 C24.1 C25.1 C26.1 C27.1 C28.1 U4.1(VDD) U4.3(VDDQ) U4.9(VDDQ) U4.14(VDD) U4.27(VDD) U4.43(VDDQ) U4.49(VDDQ) ; port 3V3_MEM_F
GND: C2.2 C3.2 C4.2 C5.2 C6.2 C7.2 C8.2 C9.2 C10.2 C11.2 C12.2 C13.2 C14.2 C15.2 C16.2 C17.2 C18.2 C19.2 C20.2 C21.2 C22.2 C23.2 C24.2 C25.2 C26.2 C27.2 C28.2 U2.6(VSSQ) U2.12(VSSQ) U2.28(VSS) U2.41(VSS) U2.46(VSSQ) U2.52(VSSQ) U2.54(VSS) U3.6(VSSQ) U3.12(VSSQ) U3.28(VSS) U3.41(VSS) U3.46(VSSQ) U3.52(VSSQ) U3.54(VSS) U4.6(VSSQ) U4.12(VSSQ) U4.28(VSS) U4.41(VSS) U4.46(VSSQ) U4.52(VSSQ) U4.54(VSS)
A0: U2.23(A0) U3.23(A0) U4.23(A0) ; port MEM_ADDR.A0
A1: U2.24(A1) U3.24(A1) U4.24(A1) ; port MEM_ADDR.A1
A2: U2.25(A2) U3.25(A2) U4.25(A2) ; port MEM_ADDR.A2
A3: U2.26(A3) U3.26(A3) U4.26(A3) ; port MEM_ADDR.A3
A4: U2.29(A4) U3.29(A4) U4.29(A4) ; port MEM_ADDR.A4
A5: U2.30(A5) U3.30(A5) U4.30(A5) ; port MEM_ADDR.A5
A6: U2.31(A6) U3.31(A6) U4.31(A6) ; port MEM_ADDR.A6
A7: U2.32(A7) U3.32(A7) U4.32(A7) ; port MEM_ADDR.A7
A8: U2.33(A8) U3.33(A8) U4.33(A8) ; port MEM_ADDR.A8
A9: U2.34(A9) U3.34(A9) U4.34(A9) ; port MEM_ADDR.A9
A10: U2.22(A10) U3.22(A10) U4.22(A10) ; port MEM_ADDR.A10
A11: U2.35(A11) U3.35(A11) U4.35(A11) ; port MEM_ADDR.A11
A12: U2.36(A12) U3.36(A12) U4.36(A12) ; port MEM_ADDR.A12
BA0: U2.20(BA0) U3.20(BA0) U4.20(BA0) ; port MEM_ADDR.BA0
BA1: U2.21(BA1) U3.21(BA1) U4.21(BA1) ; port MEM_ADDR.BA1
CAS_N: U2.17(~{CAS}) U3.17(~{CAS}) U4.17(~{CAS}) ; port MEM_CTRL.CAS_N
CKE: U2.37(CKE) U3.37(CKE) U4.37(CKE) ; port MEM_CTRL.CKE
CLK: U2.38(CLK) U3.38(CLK) U4.38(CLK) ; port MEM_CTRL.CLK
CS0_N: U2.19(~{CS}) ; port MEM_CTRL.CS0_N
CS1_N: U3.19(~{CS}) ; port MEM_CTRL.CS1_N
CS2_N: U4.19(~{CS}) ; port MEM_CTRL.CS2_N
DQ0: U2.2(DQ0) U3.2(DQ0) U4.2(DQ0) ; port MEM_DATA.DQ0
DQ1: U2.4(DQ1) U3.4(DQ1) U4.4(DQ1) ; port MEM_DATA.DQ1
DQ2: U2.5(DQ2) U3.5(DQ2) U4.5(DQ2) ; port MEM_DATA.DQ2
DQ3: U2.7(DQ3) U3.7(DQ3) U4.7(DQ3) ; port MEM_DATA.DQ3
DQ4: U2.8(DQ4) U3.8(DQ4) U4.8(DQ4) ; port MEM_DATA.DQ4
DQ5: U2.10(DQ5) U3.10(DQ5) U4.10(DQ5) ; port MEM_DATA.DQ5
DQ6: U2.11(DQ6) U3.11(DQ6) U4.11(DQ6) ; port MEM_DATA.DQ6
DQ7: U2.13(DQ7) U3.13(DQ7) U4.13(DQ7) ; port MEM_DATA.DQ7
DQ8: U2.42(DQ8) U3.42(DQ8) U4.42(DQ8) ; port MEM_DATA.DQ8
DQ9: U2.44(DQ9) U3.44(DQ9) U4.44(DQ9) ; port MEM_DATA.DQ9
DQ10: U2.45(DQ10) U3.45(DQ10) U4.45(DQ10) ; port MEM_DATA.DQ10
DQ11: U2.47(DQ11) U3.47(DQ11) U4.47(DQ11) ; port MEM_DATA.DQ11
DQ12: U2.48(DQ12) U3.48(DQ12) U4.48(DQ12) ; port MEM_DATA.DQ12
DQ13: U2.50(DQ13) U3.50(DQ13) U4.50(DQ13) ; port MEM_DATA.DQ13
DQ14: U2.51(DQ14) U3.51(DQ14) U4.51(DQ14) ; port MEM_DATA.DQ14
DQ15: U2.53(DQ15) U3.53(DQ15) U4.53(DQ15) ; port MEM_DATA.DQ15
DQMH: U2.39(DQMH) U3.39(DQMH) U4.39(DQMH) ; port MEM_CTRL.DQMH
DQML: U2.15(DQML) U3.15(DQML) U4.15(DQML) ; port MEM_CTRL.DQML
RAS_N: U2.18(~{RAS}) U3.18(~{RAS}) U4.18(~{RAS}) ; port MEM_CTRL.RAS_N
WE_N: U2.16(~{WE}) U3.16(~{WE}) U4.16(~{WE}) ; port MEM_CTRL.WE_N

Not connected (* = marked no-connect by the designer): U2 40(NC)*; U3 40(NC)*; U4 40(NC)*

### Layout directives
net class RAM_DATA; rule Length Constraint [Min Length = 50mm    Max Length = 60mm]: DQ0, DQ1, DQ2, DQ3, DQ4, DQ5, DQ6, DQ7, DQ8, DQ9, DQ10, DQ11, DQ12, DQ13, DQ14, DQ15
net class RAM_ADDR; rule Length Constraint [Min Length = 50mm    Max Length = 60mm]: A0, A1, A2, A3, A4, A5, A6, A7, A8, A9, A10, A11, A12, BA0, BA1
net class RAM_CTRL; rule Length Constraint [Min Length = 50mm    Max Length = 60mm]: CAS_N, CKE, CLK, CS0_N, DQMH, DQML, RAS_N, WE_N
net class NetClass: A0, A1, A2, A3, A4, A5, A6, A7, A8, A9, A10, A11, A12, BA0, BA1, CAS_N, CKE, CLK, CS1_N, CS2_N, DQ0, DQ1, DQ2, DQ3, DQ4, DQ5, DQ6, DQ7, DQ8, DQ9, DQ10, DQ11, DQ12, DQ13, DQ14, DQ15, DQMH, DQML, RAS_N, WE_N

### Notes on the sheet
- HARNESS AND PORTS
- To VDDQ
- To VDD
- HARSH Payload SDRAM memories
- HARSH_Payload.PrjPCB
- 4
- 8
- 1.1
- Andre Martins Pio de Mattos
- HARSH_DB
- Title:
- Size:
- Date:
- A4
- Project:
- Time:
- Sheet
- of
- Revision:
- LIRMM - SPACERADGroup
- UFSC - SpaceLab
- Institutional partnership project:
- research in memory radiation hardness
- Drawn By:
- Model:

### Library data of the parts
C2 C7 C11 C16 C20 C25 = DONE_CAP_10uF_0603_X5R: CAP CER 10uF 16V 0603 X5R; Partnumber: GRM188R61C106KAALD; Manufacturer: Murata; Tolerance: 10%; NCM: 8532.24.10; Supplier 1: Digi-Key; Manufacturer Part Number: GRM188R61C106KAALD; Stock 1: 0; Pricing 1: 1=0.43, 10=0.302, 100=0.1811, 500=0.1358, 1000=0.1147 (USD); Mount: Surface Mount; Case/Package: 0603; Weight: 0.000222oz; Case Code (Metric): 1608; Case Code (Imperial): 0603; Min Operating Temperature: -55°C; Max Operating Temperature: 85°C; Packaging: Tape and Reel; Voltage Rating: 16V; Dielectric: X5R; Termination: SMD/SMT; Composition: Ceramic; Voltage Rating (DC): 16V; Package Quantity: 4000; Length: 0.063inch; Height: 0.8mm; Width: 0.8mm; Thickness: 0.037inch; REACH SVHC: No SVHC; Lead Free: Lead Free; ComponentLink1URL: http://www.farnell.com/datasheets/2079167.pdf; ComponentLink1Description: http://www.farnell.com/datasheets/2079167.pdf; ComponentLink2URL: http://www.mouser.com/ds/2/281/c02e-2905.pdf; ComponentLink2Description: http://www.mouser.com/ds/2/281/c02e-2905.pdf; ComponentLink3URL: http://search.murata.co.jp/Ceramy/image/img/A01X/partnumbering_e_01.pdf; ComponentLink3Description: http://search.murata.co.jp/Ceramy/image/img/A01X/partnumbering_e_01.pdf; Supplier Part Number 1: 490-10728-1-ND; Capacitance: 10uF
C3-C6 C8-C10 C12-C15 C17-C19 C21-C24 C26-C28 = DONE_CAP_0.1uF_0603_X7R: as C1 on sheet 1_Interface; NCM: 8532.24.10; ComponentLink1Description: https://www.digikey.com/product-detail/en/yageo/CC0201KRX7R9BB101/311-1401-1-ND/2833707; ComponentLink1URL: https://www.digikey.com/product-detail/en/yageo/CC0201KRX7R9BB101/311-1401-1-ND/2833707; ComponentLink2Description: https://br.mouser.com/ProductDetail/Yageo/CC0201KRX7R9BB101?qs=%2Fha2pyFaduiYipKOFrxfqt3%252B9aGSfhofiweIoBBppi5CkwQHqUahpQ%3D%3D; ComponentLink2URL: https://br.mouser.com/ProductDetail/Yageo/CC0201KRX7R9BB101?qs=%2Fha2pyFaduiYipKOFrxfqt3%252B9aGSfhofiweIoBBppi5CkwQHqUahpQ%3D%3D; Supplier 1: Digi-Key; Supplier Part Number 1: 311-1401-1-ND; Stock 1: 203642; Pricing 1: 1=0.1, 10=0.017, 100=0.0078, 500=0.00554, 1000=0.00436, 2500=0.00396, 5000=0.00364 (USD); Mount: Surface Mount; Case/Package: 0201; Weight: 6E-06oz; Case Code (Metric): 0603; Case Code (Imperial): 0201; Min Operating Temperature: -55°C; Max Operating Temperature: 125°C; Tolerance: 10%; Package Quantity: 1; Voltage Rating: 50V; Packaging: Tape and Reel; Voltage Rating (DC): 50V; Termination: SMD/SMT; Composition: Ceramic; Length: 0.6mm; Height: 0.3mm; Width: 0.012inch; Thickness: 0.013inch; Depth: 0.3mm; Radiation Hardening: No; Lead Free: Lead Free; Halogen Free: Halogen Free; ComponentLink3URL: http://www.yageo.com/documents/recent/UPY-GPHC_X7R_6.3V-to-50V_18.pdf?src-supplier=Digi-Key; ComponentLink3Description: http://www.yageo.com/documents/recent/UPY-GPHC_X7R_6.3V-to-50V_18.pdf?src-supplier=Digi-Key; ComponentLink4URL: http://www.yageo.com/documents/recent/UPY-GPHC_X7R_6.3V-to-50V_8.pdf?src-supplier=Avnet+Europe; ComponentLink4Description: http://www.yageo.com/documents/recent/UPY-GPHC_X7R_6.3V-to-50V_8.pdf?src-supplier=Avnet+Europe; ComponentLink5URL: http://www.yageo.com/documents/recent/UPY-GPHC_X7R_6.3V-to-50V_8.pdf?src-supplier=Avnet; ComponentLink5Description: http://www.yageo.com/documents/recent/UPY-GPHC_X7R_6.3V-to-50V_8.pdf?src-supplier=Avnet; ComponentLink6URL: http://www.mouser.com/ds/2/447/Yageo_UPY-GP_NP0_16V-to-50V_9-358835.pdf?src-supplier=Mouser; ComponentLink6Description: http://www.mouser.com/ds/2/447/Yageo_UPY-GP_NP0_16V-to-50V_9-358835.pdf?src-supplier=Mouser; Supplier 2: Mouser; Supplier Part Number 2: 603-CC201KRX7R9BB101; Stock 2: 51204; Pricing 2: 1=0.1, 10=0.024, 100=0.011, 1000=0.009, 2500=0.006, 10000=0.006 (USD)
U2 = DONE_ISSI_MEM_MODEL_B: DRAM 512M, 3.3V, SDRAM, 32Mx16, 143MHz, 54 pin TSOP II; Partnumber: IS42S16320B-6TLI
U3 = DONE_ISSI_MEM_MODEL_D: DRAM 512M, 3.3V, SDRAM, 32Mx16, 143MHz, 54 pin TSOP II; Partnumber: IS42S16320D-7TLI
U4 = DONE_ISSI_MEM_MODEL_F: DRAM 512M, 3.3V, SDRAM, 32Mx16, 143MHz, 54 pin TSOP II; Partnumber: IS42S16320F-7TLI

## Sheet 4_FPGA_Banks_0_2.SchDoc
size A4; Organization: SpaceLab UFSC; Address1: UFSC - SpaceLab; Address2: University Campus - Trindade; Address3: Dep. of Electrical Engineering - CTC; Address4: Florianópolis, Santa Catarina, Brazil; Address5: CEP: 88040 - 900
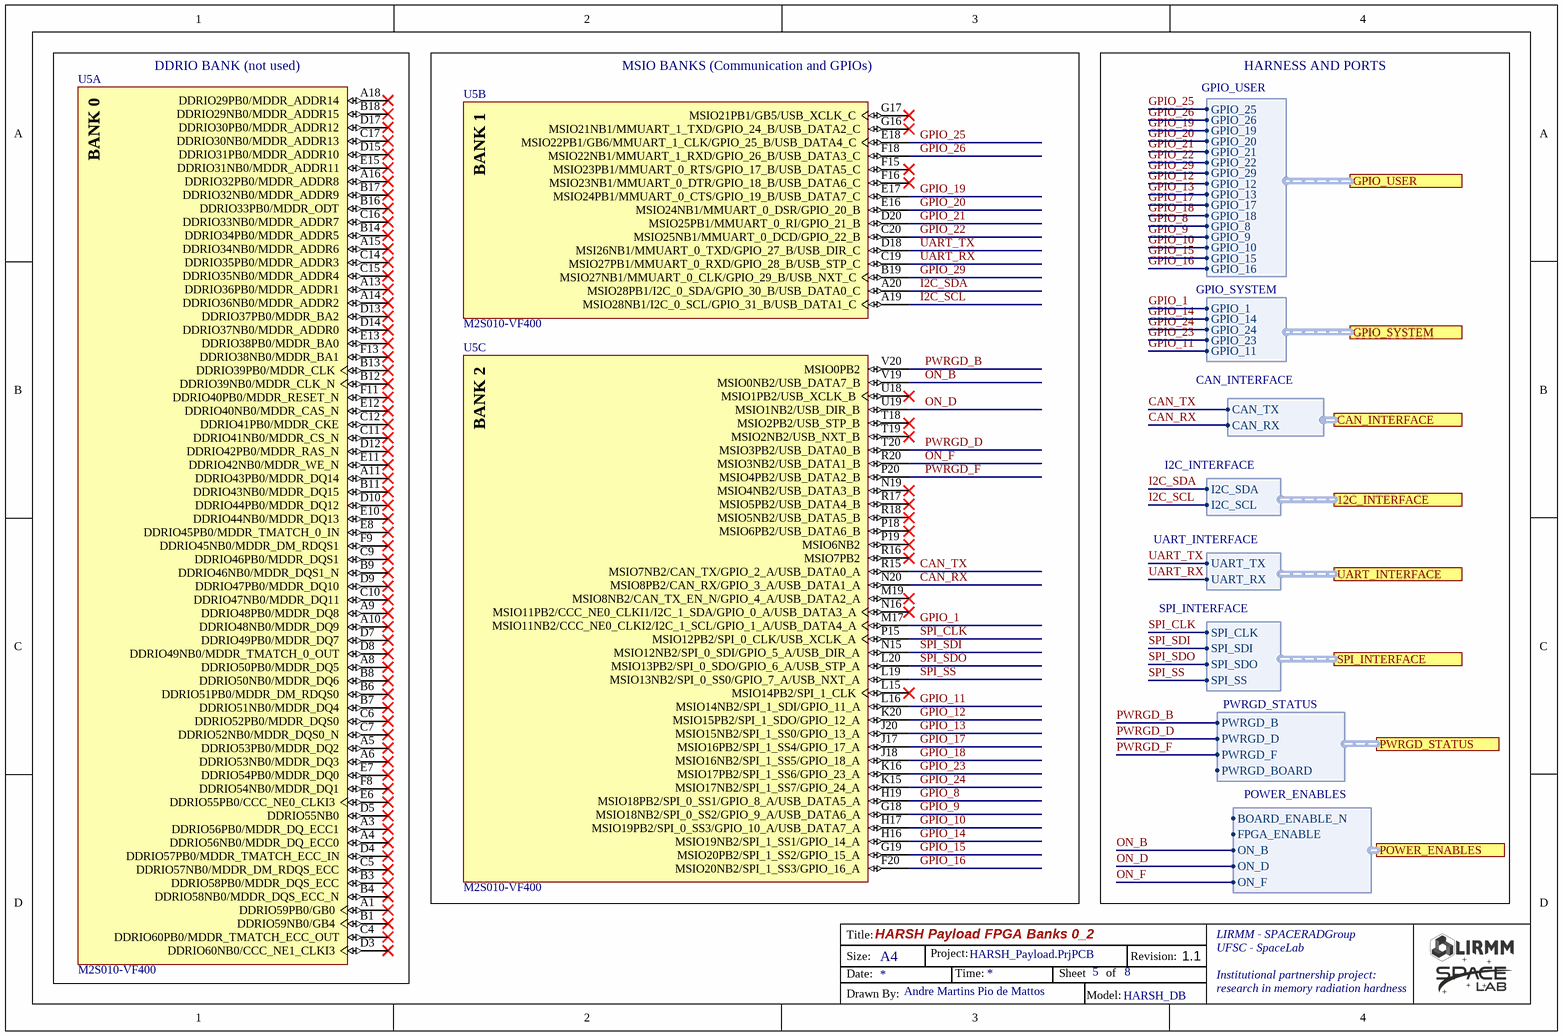
[diagram p4: 4_FPGA_Banks_0_2.SchDoc]

### Parts
U5  M2S010-VF400  [DONE_MCSM_VF_400]  (parts A,B,C of 14)

### Blocks framed on the sheet
DDRIO BANK (not used): U5
MSIO BANKS (Communication and GPIOs): U5

### Ports
12C_INTERFACE (harness I2C_INTERFACE), CAN_INTERFACE (harness CAN_INTERFACE), GPIO_SYSTEM (harness GPIO_SYSTEM), GPIO_USER (harness GPIO_USER), POWER_ENABLES (harness POWER_ENABLES), PWRGD_STATUS (harness PWRGD_STATUS), SPI_INTERFACE (harness SPI_INTERFACE), UART_INTERFACE (harness UART_INTERFACE)

### Harnesses
GPIO_USER: GPIO_25, GPIO_26, GPIO_19, GPIO_20, GPIO_21, GPIO_22, GPIO_29, GPIO_12, GPIO_13, GPIO_17, GPIO_18, GPIO_8, GPIO_9, GPIO_10, GPIO_15, GPIO_16
CAN_INTERFACE: CAN_TX, CAN_RX
GPIO_SYSTEM: GPIO_1, GPIO_14, GPIO_24, GPIO_23, GPIO_11
I2C_INTERFACE: I2C_SDA, I2C_SCL
UART_INTERFACE: UART_TX, UART_RX
SPI_INTERFACE: SPI_SDI, SPI_SDO, SPI_CLK, SPI_SS
PWRGD_STATUS: PWRGD_B, PWRGD_D, PWRGD_F, PWRGD_BOARD
POWER_ENABLES: FPGA_ENABLE, ON_B, BOARD_ENABLE_N, ON_D, ON_F

### Nets
CAN_RX: U5.N20(MSIO8PB2/CAN_RX/GPIO_3_A/USB_DATA1_A) ; port CAN_INTERFACE.CAN_RX
CAN_TX: U5.R15(MSIO7NB2/CAN_TX/GPIO_2_A/USB_DATA0_A) ; port CAN_INTERFACE.CAN_TX
GPIO_1: U5.M17(MSIO11NB2/CCC_NE0_CLKI2/I2C_1_SCL/GPIO_1_A/USB_DATA4_A) ; port GPIO_SYSTEM.GPIO_1
GPIO_8: U5.H19(MSIO18PB2/SPI_0_SS1/GPIO_8_A/USB_DATA5_A) ; port GPIO_USER.GPIO_8
GPIO_9: U5.G18(MSIO18NB2/SPI_0_SS2/GPIO_9_A/USB_DATA6_A) ; port GPIO_USER.GPIO_9
GPIO_10: U5.H17(MSIO19PB2/SPI_0_SS3/GPIO_10_A/USB_DATA7_A) ; port GPIO_USER.GPIO_10
GPIO_11: U5.L16(MSIO14NB2/SPI_1_SDI/GPIO_11_A) ; port GPIO_SYSTEM.GPIO_11
GPIO_12: U5.K20(MSIO15PB2/SPI_1_SDO/GPIO_12_A) ; port GPIO_USER.GPIO_12
GPIO_13: U5.J20(MSIO15NB2/SPI_1_SS0/GPIO_13_A) ; port GPIO_USER.GPIO_13
GPIO_14: U5.H16(MSIO19NB2/SPI_1_SS1/GPIO_14_A) ; port GPIO_SYSTEM.GPIO_14
GPIO_15: U5.G19(MSIO20PB2/SPI_1_SS2/GPIO_15_A) ; port GPIO_USER.GPIO_15
GPIO_16: U5.F20(MSIO20NB2/SPI_1_SS3/GPIO_16_A) ; port GPIO_USER.GPIO_16
GPIO_17: U5.J17(MSIO16PB2/SPI_1_SS4/GPIO_17_A) ; port GPIO_USER.GPIO_17
GPIO_18: U5.J18(MSIO16NB2/SPI_1_SS5/GPIO_18_A) ; port GPIO_USER.GPIO_18
GPIO_19: U5.E17(MSIO24PB1/MMUART_0_CTS/GPIO_19_B/USB_DATA7_C) ; port GPIO_USER.GPIO_19
GPIO_20: U5.E16(MSIO24NB1/MMUART_0_DSR/GPIO_20_B) ; port GPIO_USER.GPIO_20
GPIO_21: U5.D20(MSIO25PB1/MMUART_0_RI/GPIO_21_B) ; port GPIO_USER.GPIO_21
GPIO_22: U5.C20(MSIO25NB1/MMUART_0_DCD/GPIO_22_B) ; port GPIO_USER.GPIO_22
GPIO_23: U5.K16(MSIO17PB2/SPI_1_SS6/GPIO_23_A) ; port GPIO_SYSTEM.GPIO_23
GPIO_24: U5.K15(MSIO17NB2/SPI_1_SS7/GPIO_24_A) ; port GPIO_SYSTEM.GPIO_24
GPIO_25: U5.E18(MSIO22PB1/GB6/MMUART_1_CLK/GPIO_25_B/USB_DATA4_C) ; port GPIO_USER.GPIO_25
GPIO_26: U5.F18(MSIO22NB1/MMUART_1_RXD/GPIO_26_B/USB_DATA3_C) ; port GPIO_USER.GPIO_26
GPIO_29: U5.B19(MSIO27NB1/MMUART_0_CLK/GPIO_29_B/USB_NXT_C) ; port GPIO_USER.GPIO_29
I2C_SCL: U5.A19(MSIO28NB1/I2C_0_SCL/GPIO_31_B/USB_DATA1_C) ; port 12C_INTERFACE.I2C_SCL
I2C_SDA: U5.A20(MSIO28PB1/I2C_0_SDA/GPIO_30_B/USB_DATA0_C) ; port 12C_INTERFACE.I2C_SDA
ON_B: U5.V19(MSIO0NB2/USB_DATA7_B) ; port POWER_ENABLES.ON_B
ON_D: U5.U19(MSIO1NB2/USB_DIR_B) ; port POWER_ENABLES.ON_D
ON_F: U5.R20(MSIO3NB2/USB_DATA1_B) ; port POWER_ENABLES.ON_F
PWRGD_B: U5.V20(MSIO0PB2) ; port PWRGD_STATUS.PWRGD_B
PWRGD_D: U5.T20(MSIO3PB2/USB_DATA0_B) ; port PWRGD_STATUS.PWRGD_D
PWRGD_F: U5.P20(MSIO4PB2/USB_DATA2_B) ; port PWRGD_STATUS.PWRGD_F
SPI_CLK: U5.P15(MSIO12PB2/SPI_0_CLK/USB_XCLK_A) ; port SPI_INTERFACE.SPI_CLK
SPI_SDI: U5.N15(MSIO12NB2/SPI_0_SDI/GPIO_5_A/USB_DIR_A) ; port SPI_INTERFACE.SPI_SDI
SPI_SDO: U5.L20(MSIO13PB2/SPI_0_SDO/GPIO_6_A/USB_STP_A) ; port SPI_INTERFACE.SPI_SDO
SPI_SS: U5.L19(MSIO13NB2/SPI_0_SS0/GPIO_7_A/USB_NXT_A) ; port SPI_INTERFACE.SPI_SS
UART_RX: U5.C19(MSIO27PB1/MMUART_0_RXD/GPIO_28_B/USB_STP_C) ; port UART_INTERFACE.UART_RX
UART_TX: U5.D18(MSI26NB1/MMUART_0_TXD/GPIO_27_B/USB_DIR_C) ; port UART_INTERFACE.UART_TX

Not connected (* = marked no-connect by the designer): U5 A1(DDRIO59PB0/GB0)* A3(DDRIO56PB0/MDDR_DQ_ECC1)* A4(DDRIO56NB0/MDDR_DQ_ECC0)* A5(DDRIO53PB0/MDDR_DQ2)* A6(DDRIO53NB0/MDDR_DQ3)* A8(DDRIO50PB0/MDDR_DQ5)* A9(DDRIO48PB0/MDDR_DQ8)* A10(DDRIO48NB0/MDDR_DQ9)* A11(DDRIO43PB0/MDDR_DQ14)* A13(DDRIO36PB0/MDDR_ADDR1)* A14(DDRIO36NB0/MDDR_ADDR2)* A15(DDRIO34NB0/MDDR_ADDR6)* A16(DDRIO32PB0/MDDR_ADDR8)* A18(DDRIO29PB0/MDDR_ADDR14)* B1(DDRIO59NB0/GB4)* B3(DDRIO58PB0/MDDR_DQS_ECC)* B4(DDRIO58NB0/MDDR_DQS_ECC_N)* B6(DDRIO51PB0/MDDR_DM_RDQS0)* B7(DDRIO51NB0/MDDR_DQ4)* B8(DDRIO50NB0/MDDR_DQ6)* B9(DDRIO46NB0/MDDR_DQS1_N)* B11(DDRIO43NB0/MDDR_DQ15)* B12(DDRIO39NB0/MDDR_CLK_N)* B13(DDRIO39PB0/MDDR_CLK)* B14(DDRIO34PB0/MDDR_ADDR5)* B16(DDRIO33PB0/MDDR_ODT)* B17(DDRIO32NB0/MDDR_ADDR9)* B18(DDRIO29NB0/MDDR_ADDR15)* C4(DDRIO60PB0/MDDR_TMATCH_ECC_OUT)* C5(DDRIO57NB0/MDDR_DM_RDQS_ECC)* C6(DDRIO52PB0/MDDR_DQS0)* C7(DDRIO52NB0/MDDR_DQS0_N)* C9(DDRIO46PB0/MDDR_DQS1)* C10(DDRIO47NB0/MDDR_DQ11)* C11(DDRIO41NB0/MDDR_CS_N)* C12(DDRIO41PB0/MDDR_CKE)* C14(DDRIO35PB0/MDDR_ADDR3)* C15(DDRIO35NB0/MDDR_ADDR4)* C16(DDRIO33NB0/MDDR_ADDR7)* C17(DDRIO30NB0/MDDR_ADDR13)* D3(DDRIO60NB0/CCC_NE1_CLKI3)* D4(DDRIO57PB0/MDDR_TMATCH_ECC_IN)* D5(DDRIO55NB0)* D7(DDRIO49PB0/MDDR_DQ7)* D8(DDRIO49NB0/MDDR_TMATCH_0_OUT)* D9(DDRIO47PB0/MDDR_DQ10)* D10(DDRIO44PB0/MDDR_DQ12)* D12(DDRIO42PB0/MDDR_RAS_N)* D13(DDRIO37PB0/MDDR_BA2)* D14(DDRIO37NB0/MDDR_ADDR0)* D15(DDRIO31PB0/MDDR_ADDR10)* D17(DDRIO30PB0/MDDR_ADDR12)* E6(DDRIO55PB0/CCC_NE0_CLKI3)* E7(DDRIO54PB0/MDDR_DQ0)* E8(DDRIO45PB0/MDDR_TMATCH_0_IN)* E10(DDRIO44NB0/MDDR_DQ13)* E11(DDRIO42NB0/MDDR_WE_N)* E12(DDRIO40NB0/MDDR_CAS_N)* E13(DDRIO38PB0/MDDR_BA0)* E15(DDRIO31NB0/MDDR_ADDR11)* F8(DDRIO54NB0/MDDR_DQ1)* F9(DDRIO45NB0/MDDR_DM_RDQS1)* F11(DDRIO40PB0/MDDR_RESET_N)* F13(DDRIO38NB0/MDDR_BA1)* F15(MSIO23PB1/MMUART_0_RTS/GPIO_17_B/USB_DATA5_C)* F16(MSIO23NB1/MMUART_0_DTR/GPIO_18_B/USB_DATA6_C)* G16(MSIO21NB1/MMUART_1_TXD/GPIO_24_B/USB_DATA2_C)* G17(MSIO21PB1/GB5/USB_XCLK_C)* L15(MSIO14PB2/SPI_1_CLK)* M19(MSIO8NB2/CAN_TX_EN_N/GPIO_4_A/USB_DATA2_A)* N16(MSIO11PB2/CCC_NE0_CLKI1/I2C_1_SDA/GPIO_0_A/USB_DATA3_A)* N19(MSIO4NB2/USB_DATA3_B)* P18(MSIO6PB2/USB_DATA6_B)* P19(MSIO6NB2)* R16(MSIO7PB2)* R17(MSIO5PB2/USB_DATA4_B)* R18(MSIO5NB2/USB_DATA5_B)* T18(MSIO2PB2/USB_STP_B)* T19(MSIO2NB2/USB_NXT_B)* U18(MSIO1PB2/USB_XCLK_B)*

### Notes on the sheet
- HARNESS AND PORTS
- HARSH Payload FPGA Banks 0_2
- HARSH_Payload.PrjPCB
- 5
- 8
- 1.1
- Andre Martins Pio de Mattos
- HARSH_DB
- Title:
- Size:
- Date:
- A4
- Project:
- Time:
- Sheet
- of
- Revision:
- LIRMM - SPACERADGroup
- UFSC - SpaceLab
- Institutional partnership project:
- research in memory radiation hardness
- Drawn By:
- Model:
- (in symbol DONE_M2S010-VF400, part A) BANK 0
- (in symbol DONE_M2S010-VF400, part B) BANK 1
- (in symbol DONE_M2S010-VF400, part C) BANK 2

### Library data of the parts
U5 = DONE_M2S010-VF400: SmartFusion2 SoC FPGA, ARM Cortex-M3, 10 K LUTs, 195 User I/O, Design Security, 0 to 85 degC, 400-Ball BGA; Manufacturer: Microsemi; DDR Controllers (Count x Width): 1x18; MSIO (3.3V): 99; PLLs and CCCs: 2; eSRAM (K Bytes) Non SECDED: 80; SERDES Lanes: 4; Total User I/O: 195; eSRAM (K Bytes): 64; uSRAM1K Blocks: 22; Maximum Logic Elements: 12,084; MSIOD (2.5V): 32; eNVM (K Bytes): 256; Total RAM (K bits): 400; LSRAM 18K Blocks: 21; PartNumber: M2S010-VF400; PackageVersion: Rev. 48, 11/2013; ComponentLink1Description: Manufacturer URL; ComponentLink2Description: Datasheet; DatasheetVersion: Rev. 5; ComponentLink3URL: http://www.microsemi.com/document-portal/doc_download/131095-package-mechanical-drawings; ComponentLink1URL: http://www.microsemi.com/; ComponentLink2URL: http://www.microsemi.com/document-portal/doc_download/130717-smartfusion2-datasheet; PackageReference: VF-400; ComponentLink3Description: Package Specification; Math Blocks (18x18): 22; RoHS: FALSE; DDRIO (2.5V): 64; Mounting Technology: Surface Mount; PackageDescription: 400-Ball Very Fine Pitch Ball Grid Array, Body 17 x 17 mm, Pitch 0.8 mm

## Sheet 5_FPGA_Banks_4_7.SchDoc
size A4; Organization: SpaceLab UFSC; Address1: UFSC - SpaceLab; Address2: University Campus - Trindade; Address3: Dep. of Electrical Engineering - CTC; Address4: Florianópolis, Santa Catarina, Brazil; Address5: CEP: 88040 - 900
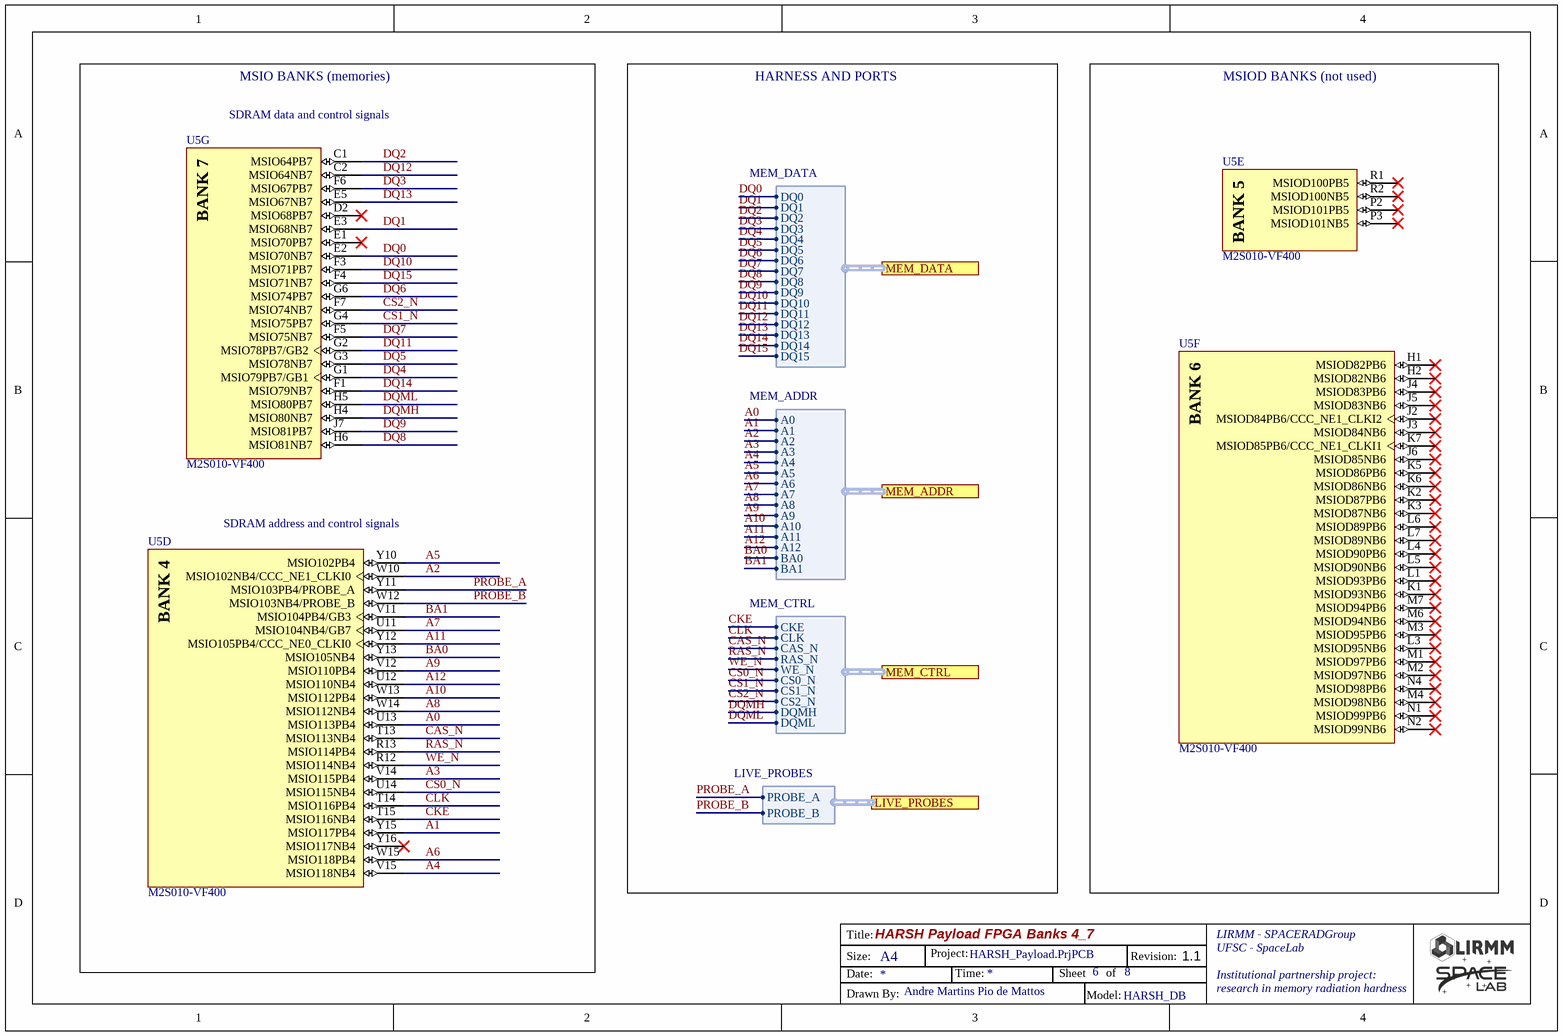
[diagram p5: 5_FPGA_Banks_4_7.SchDoc]

### Parts
U5  M2S010-VF400  [DONE_MCSM_VF_400]  (parts D,E,F,G of 14)

### Blocks framed on the sheet
MSIO BANKS (memories): U5
MSIOD BANKS (not used): U5

### Ports
LIVE_PROBES (harness LIVE_PROBES), MEM_ADDR (harness MEM_ADDR), MEM_CTRL (harness MEM_CTRL), MEM_DATA (harness MEM_DATA)

### Harnesses
MEM_DATA: DQ0, DQ1, DQ2, DQ3, DQ4, DQ5, DQ6, DQ7, DQ8, DQ9, DQ10, DQ11, DQ12, DQ13, DQ14, DQ15
MEM_ADDR: A0, A1, A2, A3, A4, A5, A6, A7, A8, A9, A10, A11, A12, BA0, BA1
MEM_CTRL: CKE, CLK, CAS_N, RAS_N, WE_N, CS0_N, CS1_N, CS2_N, DQMH, DQML
LIVE_PROBES: PROBE_A, PROBE_B

### Nets
A0: U5.U13(MSIO113PB4) ; port MEM_ADDR.A0
A1: U5.Y15(MSIO117PB4) ; port MEM_ADDR.A1
A2: U5.W10(MSIO102NB4/CCC_NE1_CLKI0) ; port MEM_ADDR.A2
A3: U5.V14(MSIO115PB4) ; port MEM_ADDR.A3
A4: U5.V15(MSIO118NB4) ; port MEM_ADDR.A4
A5: U5.Y10(MSIO102PB4) ; port MEM_ADDR.A5
A6: U5.W15(MSIO118PB4) ; port MEM_ADDR.A6
A7: U5.U11(MSIO104NB4/GB7) ; port MEM_ADDR.A7
A8: U5.W14(MSIO112NB4) ; port MEM_ADDR.A8
A9: U5.V12(MSIO110PB4) ; port MEM_ADDR.A9
A10: U5.W13(MSIO112PB4) ; port MEM_ADDR.A10
A11: U5.Y12(MSIO105PB4/CCC_NE0_CLKI0) ; port MEM_ADDR.A11
A12: U5.U12(MSIO110NB4) ; port MEM_ADDR.A12
BA0: U5.Y13(MSIO105NB4) ; port MEM_ADDR.BA0
BA1: U5.V11(MSIO104PB4/GB3) ; port MEM_ADDR.BA1
CAS_N: U5.T13(MSIO113NB4) ; port MEM_CTRL.CAS_N
CKE: U5.T15(MSIO116NB4) ; port MEM_CTRL.CKE
CLK: U5.T14(MSIO116PB4) ; port MEM_CTRL.CLK
CS0_N: U5.U14(MSIO115NB4) ; port MEM_CTRL.CS0_N
CS1_N: U5.G4(MSIO75PB7) ; port MEM_CTRL.CS1_N
CS2_N: U5.F7(MSIO74NB7) ; port MEM_CTRL.CS2_N
DQ0: U5.E2(MSIO70NB7) ; port MEM_DATA.DQ0
DQ1: U5.E3(MSIO68NB7) ; port MEM_DATA.DQ1
DQ2: U5.C1(MSIO64PB7) ; port MEM_DATA.DQ2
DQ3: U5.F6(MSIO67PB7) ; port MEM_DATA.DQ3
DQ4: U5.G1(MSIO79PB7/GB1) ; port MEM_DATA.DQ4
DQ5: U5.G3(MSIO78NB7) ; port MEM_DATA.DQ5
DQ6: U5.G6(MSIO74PB7) ; port MEM_DATA.DQ6
DQ7: U5.F5(MSIO75NB7) ; port MEM_DATA.DQ7
DQ8: U5.H6(MSIO81NB7) ; port MEM_DATA.DQ8
DQ9: U5.J7(MSIO81PB7) ; port MEM_DATA.DQ9
DQ10: U5.F3(MSIO71PB7) ; port MEM_DATA.DQ10
DQ11: U5.G2(MSIO78PB7/GB2) ; port MEM_DATA.DQ11
DQ12: U5.C2(MSIO64NB7) ; port MEM_DATA.DQ12
DQ13: U5.E5(MSIO67NB7) ; port MEM_DATA.DQ13
DQ14: U5.F1(MSIO79NB7) ; port MEM_DATA.DQ14
DQ15: U5.F4(MSIO71NB7) ; port MEM_DATA.DQ15
DQMH: U5.H4(MSIO80NB7) ; port MEM_CTRL.DQMH
DQML: U5.H5(MSIO80PB7) ; port MEM_CTRL.DQML
PROBE_A: U5.Y11(MSIO103PB4/PROBE_A) ; port LIVE_PROBES.PROBE_A
PROBE_B: U5.W12(MSIO103NB4/PROBE_B) ; port LIVE_PROBES.PROBE_B
RAS_N: U5.R13(MSIO114PB4) ; port MEM_CTRL.RAS_N
WE_N: U5.R12(MSIO114NB4) ; port MEM_CTRL.WE_N

Not connected (* = marked no-connect by the designer): U5 D2(MSIO68PB7)* E1(MSIO70PB7)* H1(MSIOD82PB6)* H2(MSIOD82NB6)* J2(MSIOD84PB6/CCC_NE1_CLKI2)* J3(MSIOD84NB6)* J4(MSIOD83PB6)* J5(MSIOD83NB6)* J6(MSIOD85NB6)* K1(MSIOD93NB6)* K2(MSIOD87PB6)* K3(MSIOD87NB6)* K5(MSIOD86PB6)* K6(MSIOD86NB6)* K7(MSIOD85PB6/CCC_NE1_CLKI1)* L1(MSIOD93PB6)* L3(MSIOD95NB6)* L4(MSIOD90PB6)* L5(MSIOD90NB6)* L6(MSIOD89PB6)* L7(MSIOD89NB6)* M1(MSIOD97PB6)* M2(MSIOD97NB6)* M3(MSIOD95PB6)* M4(MSIOD98NB6)* M6(MSIOD94NB6)* M7(MSIOD94PB6)* N1(MSIOD99PB6)* N2(MSIOD99NB6)* N4(MSIOD98PB6)* P2(MSIOD101PB5)* P3(MSIOD101NB5)* R1(MSIOD100PB5)* R2(MSIOD100NB5)* Y16(MSIO117NB4)*

### Notes on the sheet
- HARNESS AND PORTS
- (near U5) SDRAM data and control signals
- (near U5) SDRAM address and control signals
- HARSH Payload FPGA Banks 4_7
- HARSH_Payload.PrjPCB
- 6
- 8
- 1.1
- Andre Martins Pio de Mattos
- HARSH_DB
- Title:
- Size:
- Date:
- A4
- Project:
- Time:
- Sheet
- of
- Revision:
- LIRMM - SPACERADGroup
- UFSC - SpaceLab
- Institutional partnership project:
- research in memory radiation hardness
- Drawn By:
- Model:
- (in symbol DONE_M2S010-VF400, part D) BANK 4
- (in symbol DONE_M2S010-VF400, part E) BANK 5
- (in symbol DONE_M2S010-VF400, part F) BANK 6
- (in symbol DONE_M2S010-VF400, part G) BANK 7

### Library data of the parts
U5 = DONE_M2S010-VF400: as U5 on sheet 4_FPGA_Banks_0_2; PartNumber: M2S010-VF400; PackageVersion: Rev. 48, 11/2013; ComponentLink1Description: Manufacturer URL; ComponentLink2Description: Datasheet; DatasheetVersion: Rev. 5; ComponentLink3URL: http://www.microsemi.com/document-portal/doc_download/131095-package-mechanical-drawings; ComponentLink1URL: http://www.microsemi.com/; ComponentLink2URL: http://www.microsemi.com/document-portal/doc_download/130717-smartfusion2-datasheet; PackageReference: VF-400; ComponentLink3Description: Package Specification; Math Blocks (18x18): 22; RoHS: FALSE; DDRIO (2.5V): 64; Mounting Technology: Surface Mount; PackageDescription: 400-Ball Very Fine Pitch Ball Grid Array, Body 17 x 17 mm, Pitch 0.8 mm